# Altium schematic sheet power.SchDoc
size A
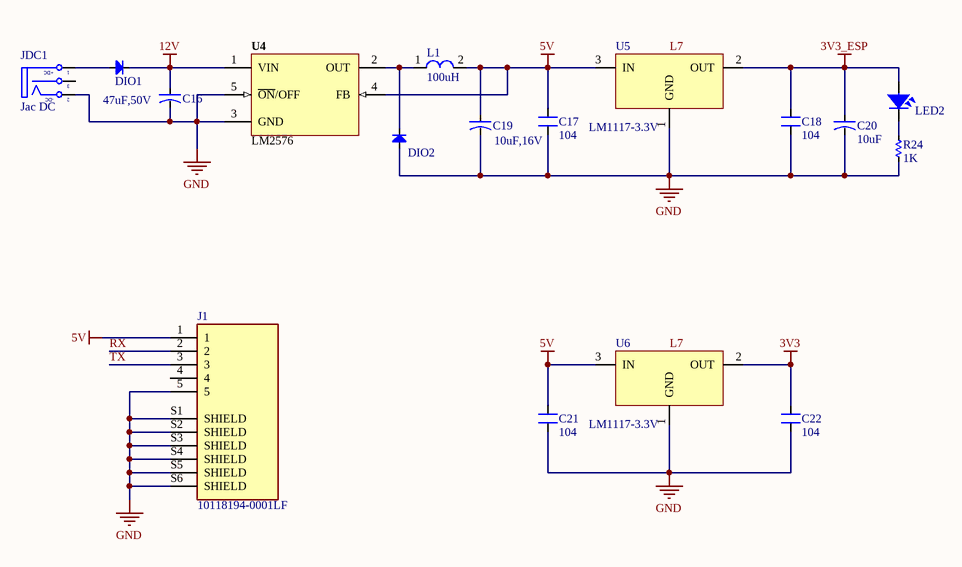
[diagram p0: power.SchDoc]

## Parts
C16  47uF,50V  [CAP-ALU-SMD-6.3x7.7x2.2]
C17  104  [SM-CAP-0805]
C18  104  [SM-CAP-0805]
C19  10uF,16V  [CAP-ALU-SMD-6.3x7.7x2.2]
C20  10uF  [CAP-ALU-SMD-5x5.5x1.4]
C21  104  [SM-CAP-0805]
C22  104  [SM-CAP-0805]
DIO1  Diode SMD  [DIO-SMD-106]  (value not drawn)
DIO2  Diode SMD  [DIO-SMD-106]  (value not drawn)
J1  10118194-0001LF  [AMPHENOL_10118194-0001LF]
JDC1  Jac DC  [DC0]
L1  100uH  [L-SMD-M-12x10]
LED2  LED  [LED-0805-Blue]  (value not drawn)
R24  1K  [RES-SMD-0805]
U4  LM2576  [TO263]
U5  LM1117-3.3V  [SOT223]
U6  LM1117-3.3V  [SOT223]

## Nets
3V3: C22.2 U6.2(OUT)
3V3_ESP: C18.2 C20.1 LED2.1 U5.2(OUT)
5V: C17.2 C19.1 C21.2 J1.1 L1.2 U4.4(FB) U5.3(IN) U6.3(IN)
12V: C16.1 DIO1.2(K) U4.1(VIN)
GND: C16.2 C17.1 C18.1 C19.2 C20.2 C21.1 C22.1 DIO2.1(A) J1.5 J1.S1(SHIELD) J1.S2(SHIELD) J1.S3(SHIELD) J1.S4(SHIELD) J1.S5(SHIELD) J1.S6(SHIELD) JDC1.2(TN) R24.1 U4.3(GND) U4.5(~{ON}/OFF) U5.1(GND) U6.1(GND)
RX: J1.2
TX: J1.3
NetDIO1_1: DIO1.1(A) JDC1.1(T)
NetDIO2_2: DIO2.2(K) L1.1 U4.2(OUT)
NetLED2_2: LED2.2 R24.2

Not connected (* = marked no-connect by the designer): J1 4; JDC1 3(S)

## Notes on the sheet
- Labels drawn without touching a wire or pin: L7
- (in symbol DCIN) +DC; -DC

## Library data of the parts
C16 C19 C20 = CN-ALU-SMD: Polarized Capacitor (Axial); Published: 8-Jun-2000; LatestRevisionDate: 17-Jul-2002; LatestRevisionNote: Re-released for DXP Platform.; PackageReference: POLAR0.8; Publisher: Altium Limited
C17 C18 C21 C22 = CN: Value: 0,1uF/300V; Designed by: VanDungEvn
DIO1 DIO2 = Diode SMD: Default Diode; Code - JEDEC: DO-214-AB; Value: 1N5007; Published: 8-Jun-2000; Revision: July-2002: Re-released for DXP Platform.; Publisher: Altium Limited
J1 = 10118194-0001LF: USB - micro B USB 2.0 Receptacle Connector 5 Position Surface Mount, Right Angle; Through Hole; MF: Amphenol ICC; Package: None; Price: None; Availability: Unavailable; MP: 10118194-0001LF; SnapEDA_Link: https://www.snapeda.com/parts/10118194-0001LF/Amphenol%20FCI/view-part/1413308/?ref=snap; Value: *
JDC1 = DCIN: Jac DC input; Value: Jac DC
L1 = L-SMD-1: partNo: 78477010; Manufacturer: Wurth Elektronik; Inductance: 1.0 μH; ComponentLink1Description: Manufacturer; ComponentLink1URL: http://www.we-online.de; Created by: Baojun Chen; Created Date: Nov.2015; ComponentLink2Description: Datasheet; ComponentLink2URL: http://katalog.we-online.de/pbs/datasheet/78477010.pdf
LED2 = LED SMD: Value: LED 3 - 5 ly 2 Colour
R24 = Res-SMD: Resistor; Manufacturer: Generic Components; Class: Passive; Published: 08/06/2000; Publisher: Altium Hobart Technology Centre
U4 = LM2576: Max Input Voltage: 12 V; Max Output Current: 3 (6.0 peak) A; Max Output Voltage: mV; Category: IC-Power; Min Input Voltage: mV; Min Output Voltage: mV; Mounting Technology: Surface Mount; Status: Unreleased; Supply Voltage: mV; Temperature Range: -40 to +125 degC
U5 U6 = LM1117: 800mA Low-Dropout Linear Regulator; Creator: Nguyen Ba Bien; Website: http://group3i.net